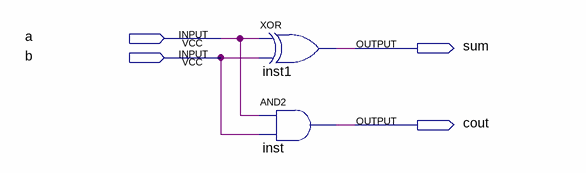
[diagram p0: schematic sheet]
// Quartus schematic add_half.bdf as structural Verilog: 2 symbols, 4 pins
module add_half (
  input  a,
  input  b,
  output sum,
  output cout
);

  xor inst1 (sum, a, b);
  and inst (cout, a, b);
endmodule
